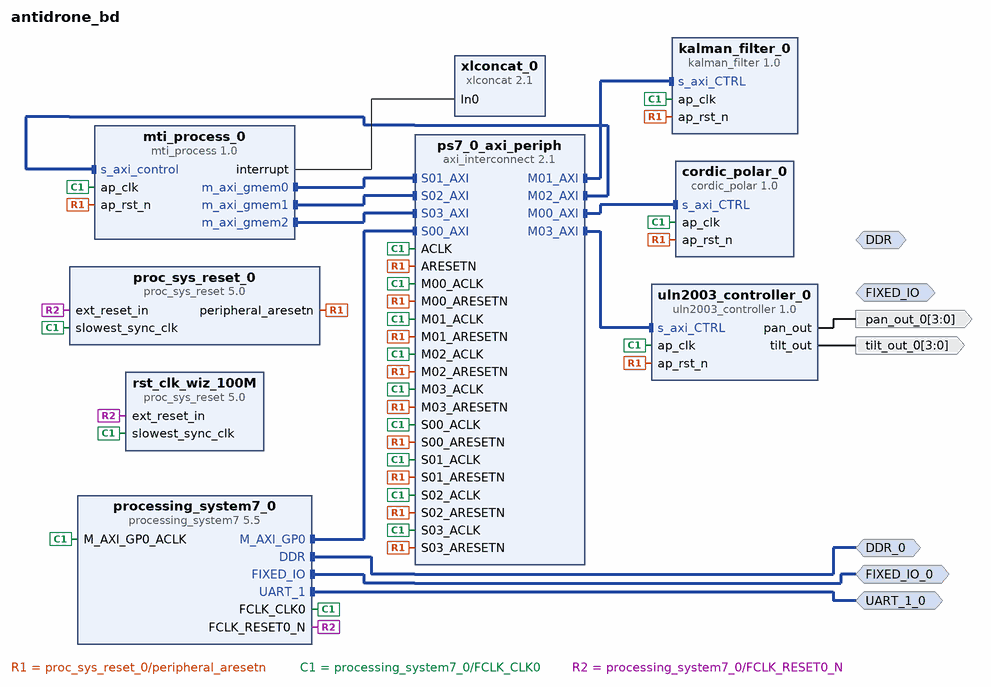
[diagram p0: block diagram of the top level]
# Vivado block design antidrone_bd, xc7z020clg400-1, Vivado 2023.2
create_bd_design antidrone_bd

create_bd_intf_port -mode Master -vlnv xilinx.com:interface:ddrx_rtl:1.0 DDR
create_bd_intf_port -mode Master -vlnv xilinx.com:display_processing_system7:fixedio_rtl:1.0 FIXED_IO
create_bd_intf_port -mode Master -vlnv xilinx.com:interface:ddrx_rtl:1.0 DDR_0
create_bd_intf_port -mode Master -vlnv xilinx.com:display_processing_system7:fixedio_rtl:1.0 FIXED_IO_0
create_bd_intf_port -mode Master -vlnv xilinx.com:interface:uart_rtl:1.0 UART_1_0
create_bd_port -dir O -from 3 -to 0 -type data pan_out_0
create_bd_port -dir O -from 3 -to 0 -type data tilt_out_0

create_bd_cell -type ip -vlnv xilinx.com:ip:proc_sys_reset:5.0 proc_sys_reset_0
create_bd_cell -type ip -vlnv xilinx.com:ip:xlconcat:2.1 xlconcat_0
set_property -dict {CONFIG.NUM_PORTS 1} [get_bd_cells xlconcat_0]
create_bd_cell -type ip -vlnv xilinx.com:ip:proc_sys_reset:5.0 rst_clk_wiz_100M
create_bd_cell -type ip -vlnv xilinx.com:ip:processing_system7:5.5 processing_system7_0
set_property -dict [list \
  CONFIG.PCW_APU_PERIPHERAL_FREQMHZ 650 \
  CONFIG.PCW_CRYSTAL_PERIPHERAL_FREQMHZ 50 \
  CONFIG.PCW_ENET0_ENET0_IO {MIO 16 .. 27} \
  CONFIG.PCW_ENET0_GRP_MDIO_ENABLE 1 \
  CONFIG.PCW_ENET0_GRP_MDIO_IO {MIO 52 .. 53} \
  CONFIG.PCW_ENET0_PERIPHERAL_ENABLE 1 \
  CONFIG.PCW_ENET0_RESET_ENABLE 1 \
  CONFIG.PCW_ENET0_RESET_IO {MIO 9} \
  CONFIG.PCW_ENET_RESET_ENABLE 1 \
  CONFIG.PCW_ENET_RESET_SELECT {Share reset pin} \
  CONFIG.PCW_FPGA0_PERIPHERAL_FREQMHZ 100 \
  CONFIG.PCW_FPGA1_PERIPHERAL_FREQMHZ 50 \
  CONFIG.PCW_GPIO_MIO_GPIO_ENABLE 1 \
  CONFIG.PCW_GPIO_MIO_GPIO_IO MIO \
  CONFIG.PCW_I2C_RESET_ENABLE 1 \
  CONFIG.PCW_M_AXI_GP0_FREQMHZ 10 \
  CONFIG.PCW_PERIPHERAL_BOARD_PRESET part0 \
  CONFIG.PCW_PRESET_BANK1_VOLTAGE {LVCMOS 1.8V} \
  CONFIG.PCW_QSPI_GRP_FBCLK_ENABLE 1 \
  CONFIG.PCW_QSPI_GRP_FBCLK_IO {MIO 8} \
  CONFIG.PCW_QSPI_GRP_SINGLE_SS_ENABLE 1 \
  CONFIG.PCW_QSPI_GRP_SINGLE_SS_IO {MIO 1 .. 6} \
  CONFIG.PCW_QSPI_PERIPHERAL_ENABLE 1 \
  CONFIG.PCW_QSPI_QSPI_IO {MIO 1 .. 6} \
  CONFIG.PCW_SD0_GRP_CD_ENABLE 1 \
  CONFIG.PCW_SD0_GRP_CD_IO {MIO 47} \
  CONFIG.PCW_SD0_GRP_WP_ENABLE 0 \
  CONFIG.PCW_SD0_PERIPHERAL_ENABLE 1 \
  CONFIG.PCW_SD0_SD0_IO {MIO 40 .. 45} \
  CONFIG.PCW_SDIO_PERIPHERAL_FREQMHZ 50 \
  CONFIG.PCW_SINGLE_QSPI_DATA_MODE x4 \
  CONFIG.PCW_UART0_PERIPHERAL_ENABLE 1 \
  CONFIG.PCW_UART0_UART0_IO {MIO 14 .. 15} \
  CONFIG.PCW_UART1_PERIPHERAL_ENABLE 1 \
  CONFIG.PCW_UART1_UART1_IO EMIO \
  CONFIG.PCW_UART_PERIPHERAL_FREQMHZ 100 \
  CONFIG.PCW_UIPARAM_DDR_BUS_WIDTH {16 Bit} \
  CONFIG.PCW_UIPARAM_DDR_FREQ_MHZ 525 \
  CONFIG.PCW_UIPARAM_DDR_PARTNO {MT41J256M16 RE-125} \
  CONFIG.PCW_USB0_PERIPHERAL_ENABLE 1 \
  CONFIG.PCW_USB0_RESET_ENABLE 1 \
  CONFIG.PCW_USB0_RESET_IO {MIO 46} \
  CONFIG.PCW_USB0_USB0_IO {MIO 28 .. 39} \
  CONFIG.PCW_USB_RESET_ENABLE 1 \
  CONFIG.PCW_USB_RESET_SELECT {Share reset pin} \
] [get_bd_cells processing_system7_0]
# 490 more settings of processing_system7_0 are not shown: defaults, MIO pin electricals, DDR timing, and values the tool derives
create_bd_cell -type ip -vlnv xilinx.com:hls:mti_process:1.0 mti_process_0
create_bd_cell -type ip -vlnv xilinx.com:hls:uln2003_controller:1.0 uln2003_controller_0
create_bd_cell -type ip -vlnv xilinx.com:hls:kalman_filter:1.0 kalman_filter_0
create_bd_cell -type ip -vlnv xilinx.com:hls:cordic_polar:1.0 cordic_polar_0
create_bd_cell -type ip -vlnv xilinx.com:ip:axi_interconnect:2.1 ps7_0_axi_periph
set_property -dict {CONFIG.NUM_MI 4 CONFIG.NUM_SI 4} [get_bd_cells ps7_0_axi_periph]

# ---- connections ----

connect_bd_intf_net [get_bd_intf_pins mti_process_0/m_axi_gmem0] [get_bd_intf_pins ps7_0_axi_periph/S01_AXI]
connect_bd_intf_net [get_bd_intf_pins mti_process_0/m_axi_gmem1] [get_bd_intf_pins ps7_0_axi_periph/S02_AXI]
connect_bd_intf_net [get_bd_intf_pins mti_process_0/m_axi_gmem2] [get_bd_intf_pins ps7_0_axi_periph/S03_AXI]
connect_bd_intf_net [get_bd_intf_ports DDR_0] [get_bd_intf_pins processing_system7_0/DDR]
connect_bd_intf_net [get_bd_intf_ports FIXED_IO_0] [get_bd_intf_pins processing_system7_0/FIXED_IO]
connect_bd_intf_net [get_bd_intf_pins processing_system7_0/M_AXI_GP0] [get_bd_intf_pins ps7_0_axi_periph/S00_AXI]
connect_bd_intf_net [get_bd_intf_ports UART_1_0] [get_bd_intf_pins processing_system7_0/UART_1]
connect_bd_intf_net [get_bd_intf_pins ps7_0_axi_periph/M00_AXI] [get_bd_intf_pins cordic_polar_0/s_axi_CTRL]
connect_bd_intf_net [get_bd_intf_pins ps7_0_axi_periph/M01_AXI] [get_bd_intf_pins kalman_filter_0/s_axi_CTRL]
connect_bd_intf_net [get_bd_intf_pins ps7_0_axi_periph/M02_AXI] [get_bd_intf_pins mti_process_0/s_axi_control]
connect_bd_intf_net [get_bd_intf_pins ps7_0_axi_periph/M03_AXI] [get_bd_intf_pins uln2003_controller_0/s_axi_CTRL]
connect_bd_net [get_bd_pins mti_process_0/interrupt] [get_bd_pins xlconcat_0/In0]
connect_bd_net [get_bd_pins proc_sys_reset_0/peripheral_aresetn] \
  [get_bd_pins mti_process_0/ap_rst_n] [get_bd_pins ps7_0_axi_periph/S00_ARESETN] [get_bd_pins ps7_0_axi_periph/M00_ARESETN] \
  [get_bd_pins ps7_0_axi_periph/ARESETN] [get_bd_pins ps7_0_axi_periph/M01_ARESETN] \
  [get_bd_pins ps7_0_axi_periph/M02_ARESETN] [get_bd_pins ps7_0_axi_periph/M03_ARESETN] \
  [get_bd_pins ps7_0_axi_periph/S01_ARESETN] [get_bd_pins ps7_0_axi_periph/S02_ARESETN] \
  [get_bd_pins ps7_0_axi_periph/S03_ARESETN] [get_bd_pins cordic_polar_0/ap_rst_n] [get_bd_pins kalman_filter_0/ap_rst_n] \
  [get_bd_pins uln2003_controller_0/ap_rst_n]
connect_bd_net -net ps7_0_FCLK_CLK0 [get_bd_pins processing_system7_0/FCLK_CLK0] \
  [get_bd_pins processing_system7_0/M_AXI_GP0_ACLK] [get_bd_pins proc_sys_reset_0/slowest_sync_clk] \
  [get_bd_pins rst_clk_wiz_100M/slowest_sync_clk] [get_bd_pins mti_process_0/ap_clk] [get_bd_pins ps7_0_axi_periph/ACLK] \
  [get_bd_pins ps7_0_axi_periph/S00_ACLK] [get_bd_pins ps7_0_axi_periph/M00_ACLK] [get_bd_pins ps7_0_axi_periph/M01_ACLK] \
  [get_bd_pins ps7_0_axi_periph/M02_ACLK] [get_bd_pins ps7_0_axi_periph/M03_ACLK] [get_bd_pins ps7_0_axi_periph/S01_ACLK] \
  [get_bd_pins ps7_0_axi_periph/S02_ACLK] [get_bd_pins ps7_0_axi_periph/S03_ACLK] [get_bd_pins cordic_polar_0/ap_clk] \
  [get_bd_pins kalman_filter_0/ap_clk] [get_bd_pins uln2003_controller_0/ap_clk]
connect_bd_net -net ps7_0_FCLK_RESET0_N [get_bd_pins processing_system7_0/FCLK_RESET0_N] \
  [get_bd_pins proc_sys_reset_0/ext_reset_in] [get_bd_pins rst_clk_wiz_100M/ext_reset_in]
connect_bd_net [get_bd_pins uln2003_controller_0/pan_out] [get_bd_ports pan_out_0]
connect_bd_net [get_bd_pins uln2003_controller_0/tilt_out] [get_bd_ports tilt_out_0]

# ---- address map ----
assign_bd_address -offset 0x0000000040020000 -range 64K -target_address_space [get_bd_addr_spaces mti_process_0/Data_m_axi_gmem0] [get_bd_addr_segs mti_process_0/s_axi_control/Reg]
exclude_bd_addr_seg -offset 0x0000000040000000 -range 64K -target_address_space [get_bd_addr_spaces mti_process_0/Data_m_axi_gmem0] [get_bd_addr_segs cordic_polar_0/s_axi_CTRL/Reg]
exclude_bd_addr_seg -offset 0x0000000040010000 -range 64K -target_address_space [get_bd_addr_spaces mti_process_0/Data_m_axi_gmem0] [get_bd_addr_segs kalman_filter_0/s_axi_CTRL/Reg]
exclude_bd_addr_seg -offset 0x0000000040030000 -range 64K -target_address_space [get_bd_addr_spaces mti_process_0/Data_m_axi_gmem0] [get_bd_addr_segs uln2003_controller_0/s_axi_CTRL/Reg]
assign_bd_address -offset 0x0000000040020000 -range 64K -target_address_space [get_bd_addr_spaces mti_process_0/Data_m_axi_gmem1] [get_bd_addr_segs mti_process_0/s_axi_control/Reg]
exclude_bd_addr_seg -offset 0x0000000040000000 -range 64K -target_address_space [get_bd_addr_spaces mti_process_0/Data_m_axi_gmem1] [get_bd_addr_segs cordic_polar_0/s_axi_CTRL/Reg]
exclude_bd_addr_seg -offset 0x0000000040000000 -range 64K -target_address_space [get_bd_addr_spaces mti_process_0/Data_m_axi_gmem1] [get_bd_addr_segs cordic_polar_0/s_axi_CTRL/Reg]
exclude_bd_addr_seg -offset 0x0000000040010000 -range 64K -target_address_space [get_bd_addr_spaces mti_process_0/Data_m_axi_gmem1] [get_bd_addr_segs kalman_filter_0/s_axi_CTRL/Reg]
exclude_bd_addr_seg -offset 0x0000000040010000 -range 64K -target_address_space [get_bd_addr_spaces mti_process_0/Data_m_axi_gmem1] [get_bd_addr_segs kalman_filter_0/s_axi_CTRL/Reg]
exclude_bd_addr_seg -offset 0x0000000040030000 -range 64K -target_address_space [get_bd_addr_spaces mti_process_0/Data_m_axi_gmem1] [get_bd_addr_segs uln2003_controller_0/s_axi_CTRL/Reg]
assign_bd_address -offset 0x0000000040020000 -range 64K -target_address_space [get_bd_addr_spaces mti_process_0/Data_m_axi_gmem2] [get_bd_addr_segs mti_process_0/s_axi_control/Reg]
exclude_bd_addr_seg -offset 0x0000000040000000 -range 64K -target_address_space [get_bd_addr_spaces mti_process_0/Data_m_axi_gmem2] [get_bd_addr_segs cordic_polar_0/s_axi_CTRL/Reg]
exclude_bd_addr_seg -offset 0x0000000040000000 -range 64K -target_address_space [get_bd_addr_spaces mti_process_0/Data_m_axi_gmem2] [get_bd_addr_segs cordic_polar_0/s_axi_CTRL/Reg]
exclude_bd_addr_seg -offset 0x0000000040010000 -range 64K -target_address_space [get_bd_addr_spaces mti_process_0/Data_m_axi_gmem2] [get_bd_addr_segs kalman_filter_0/s_axi_CTRL/Reg]
exclude_bd_addr_seg -offset 0x0000000040010000 -range 64K -target_address_space [get_bd_addr_spaces mti_process_0/Data_m_axi_gmem2] [get_bd_addr_segs kalman_filter_0/s_axi_CTRL/Reg]
exclude_bd_addr_seg -offset 0x0000000040030000 -range 64K -target_address_space [get_bd_addr_spaces mti_process_0/Data_m_axi_gmem2] [get_bd_addr_segs uln2003_controller_0/s_axi_CTRL/Reg]
assign_bd_address -offset 0x40000000 -range 64K -target_address_space [get_bd_addr_spaces processing_system7_0/Data] [get_bd_addr_segs cordic_polar_0/s_axi_CTRL/Reg]
assign_bd_address -offset 0x40000000 -range 64K -target_address_space [get_bd_addr_spaces processing_system7_0/Data] [get_bd_addr_segs cordic_polar_0/s_axi_CTRL/Reg]
assign_bd_address -offset 0x40010000 -range 64K -target_address_space [get_bd_addr_spaces processing_system7_0/Data] [get_bd_addr_segs kalman_filter_0/s_axi_CTRL/Reg]
assign_bd_address -offset 0x40010000 -range 64K -target_address_space [get_bd_addr_spaces processing_system7_0/Data] [get_bd_addr_segs kalman_filter_0/s_axi_CTRL/Reg]
assign_bd_address -offset 0x40020000 -range 64K -target_address_space [get_bd_addr_spaces processing_system7_0/Data] [get_bd_addr_segs mti_process_0/s_axi_control/Reg]
assign_bd_address -offset 0x40030000 -range 64K -target_address_space [get_bd_addr_spaces processing_system7_0/Data] [get_bd_addr_segs uln2003_controller_0/s_axi_CTRL/Reg]

validate_bd_design
save_bd_design
